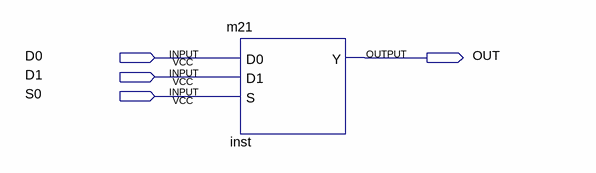
[diagram p0: schematic sheet]
// Quartus schematic TestingForMux21.bdf as structural Verilog: 1 symbols, 4 pins
module TestingForMux21 (
  input  D0,
  input  D1,
  input  S0,
  output OUT
);

  m21 inst (.D0(D0), .D1(D1), .S(S0), .Y(OUT));
endmodule
